# EAGLE design ssr (EAGLE 6.2)
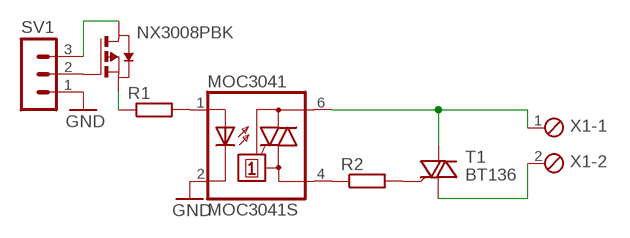
[diagram p0: schematic, sheet 1]

## Parts
MOC3041  MOC3041S  [DIL6-SMD]
NX3008PBK  PMOSSOT23  [SOT-23]
R1  R-EU_R1206  [R1206]
R2  R-EU_R1206  [R1206]
SV1  MA03-1  [MA03-1]
T1  BT136  [TO220AB]
X1  MPT2  [2POL254]

## Nets
GND: MOC3041.2(C) SV1.1
N$1: MOC3041.1(A) R1.2
N$2: NX3008PBK.2(S) R1.1
N$3: MOC3041.4(A1) R2.1
N$4: R2.2 T1.3(G)
N$5: MOC3041.6(A2) T1.2(A2) X1.1
N$6: T1.1(A1) X1.2
N$7: NX3008PBK.3(G) SV1.2
N$8: NX3008PBK.1(D) SV1.3

## Library data of the parts
MOC3041 = optocoupler:MOC30*: 6-Pin DIP Zero-Cross Optoisolators Triac Driver Output (250/400 Volt Peak) Source: http://www.fairchildsemi.com/ds/MO/MOC3043-M.pdf; MF: FAIRCHILD SEMICONDUCTOR; MPN: MOC3041S-M; OC_FARNELL: unknown; OC_NEWARK: 05C2885
NX3008PBK = zetex:PMOSSOT23: MOS FET; OC_FARNELL: unknown; OC_NEWARK: unknown
R1 R2 = rcl:R-EU_: RESISTOR, European symbol
SV1 = con-lstb:MA03-1: PIN HEADER; OC_FARNELL: unknown; OC_NEWARK: unknown
T1 = triac:BT136: Triac BT136 series E sensitive gate Source: http://www.nxp.com/acrobat_download/datasheets/BT136_SERIES_E_2.pdf
X1 = con-phoenix-254:MPT2: PHOENIX CONNECTOR; OC_FARNELL: unknown; OC_NEWARK: unknown

## Board
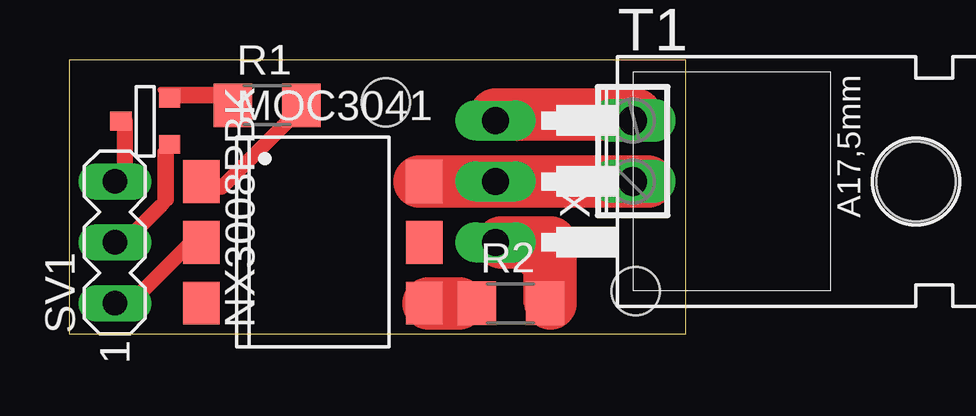
[diagram p1: board, top side]

Size 25.7 x 11.42 mm. Coordinates in mm from the lower left corner, seen from the top.
Outline: 0,0 25.7,0 25.7,11.42 0,11.42 0,0
Copper layers (1*16): Top 0.035mm / dielectric 1.5mm / Bottom 0.035mm
Design rules: minimum track width 10mil, minimum drill 24mil, track to track 8mil, track to pad 8mil, pad to pad 8mil, via to via 8mil, smd to smd 8mil, copper to edge 40mil, drill to drill 8mil, minimum pad ring 10mil, minimum via ring 8mil, stop-mask expansion 4mil, vias tented up to drill 0mil, thermal gap 10mil
Holes 2 mm at 23.62,1.78 13.21,9.65

### Footprints (pad centres in the part's own frame; a part is rotated, then mirrored left to right if it is on the bottom)
DIL6-SMD = smd 1.78 x 1.52: 1 -2.54,-4.645; 2 0,-4.645; 3 2.54,-4.645; 4 2.54,4.645; 5 0,4.645; 6 -2.54,4.645
SOT-23 = smd 0.787 x 0.889: 1 0.025,-1.016; 2 -0.94,1.016; 3 0.991,1.016
R1206 = smd 1.6 x 1.803: 1 -1.422,0; 2 1.422,0
MA03-1 = drill 1.016 long: 1 -2.54,0; 2 0,0; 3 2.54,0
TO220AB = drill 1.118 long: 1 -2.54,-6.35; 2 0,-6.35; 3 2.54,-6.35 | hole 3.302: 0,11.176
2POL254 = drill 1.2 long: 1 -1.27,0; 2 1.27,0

### Placement (x,y rotation side)
MOC3041  10.16,3.81 270 top
NX3008PBK  3.17,8.89 270 top
R1  8.26,9.53 0 top
R2  18.41,1.27 0 top
SV1  1.91,3.81 90 top
T1  24.13,6.35 270 top
X1  23.5,7.62 90 top

### Tracks (layer width: path | path; a pad name or v marks a point on that pad's centre or on a via)
GND
  Top 0.254: 2.54,1.27 5.08,3.81 MOC3041.2 | 2.03,1.27 SV1.1
  Top 0.61: 2.03,1.27 2.54,1.27 5.33,4.06
N$1
  Top 0.254: 5.08,6.35 MOC3041.1 6.35,6.35 8.89,8.89 R1.2
N$2
  Top 0.254: NX3008PBK.2 3.81,10.16 6.35,10.16 R1.1
N$3
  Top 0.254: R2.1 16.26,1.27 | 14.99,1.27 MOC3041.4
  Top 2.184: 14.99,1.27 16.26,1.27
N$4
  Top 0.254: T1.3 19.05,2.54 19.05,1.27 R2.2
N$5
  Top 0.254: MOC3041.6 T1.2 X1.1
N$6
  Top 0.254: X1.2 T1.1
N$7
  Top 0.254: NX3008PBK.3 3.81,7.62 3.81,5.33 3.81,5.08 2.54,3.81 SV1.2
  Top 0.61: 1.78,3.81 2.29,3.81 3.81,5.33 4.06,5.59 4.06,7.62
N$8
  Top 0.254: NX3008PBK.1 2.54,8.89 2.54,6.35 2.29,6.35 SV1.3
  Top 0.61: 2.29,6.35 2.29,8.89
N$9
  Top 2.184: 14.61,6.35 24.13,6.35
N$10
  Top 2.184: 17.78,9.14 23.62,9.14
N$11
  Top 2.184: 18.03,3.81 20.07,3.81 20.07,1.27
N$12
  Top 0.61: 4.06,9.91 6.35,9.91
N$13
  Top 0.61: 6.1,6.1 6.35,6.1 9.65,9.4